# EAGLE schematic Audio Amplifier (EAGLE 7.5.0)
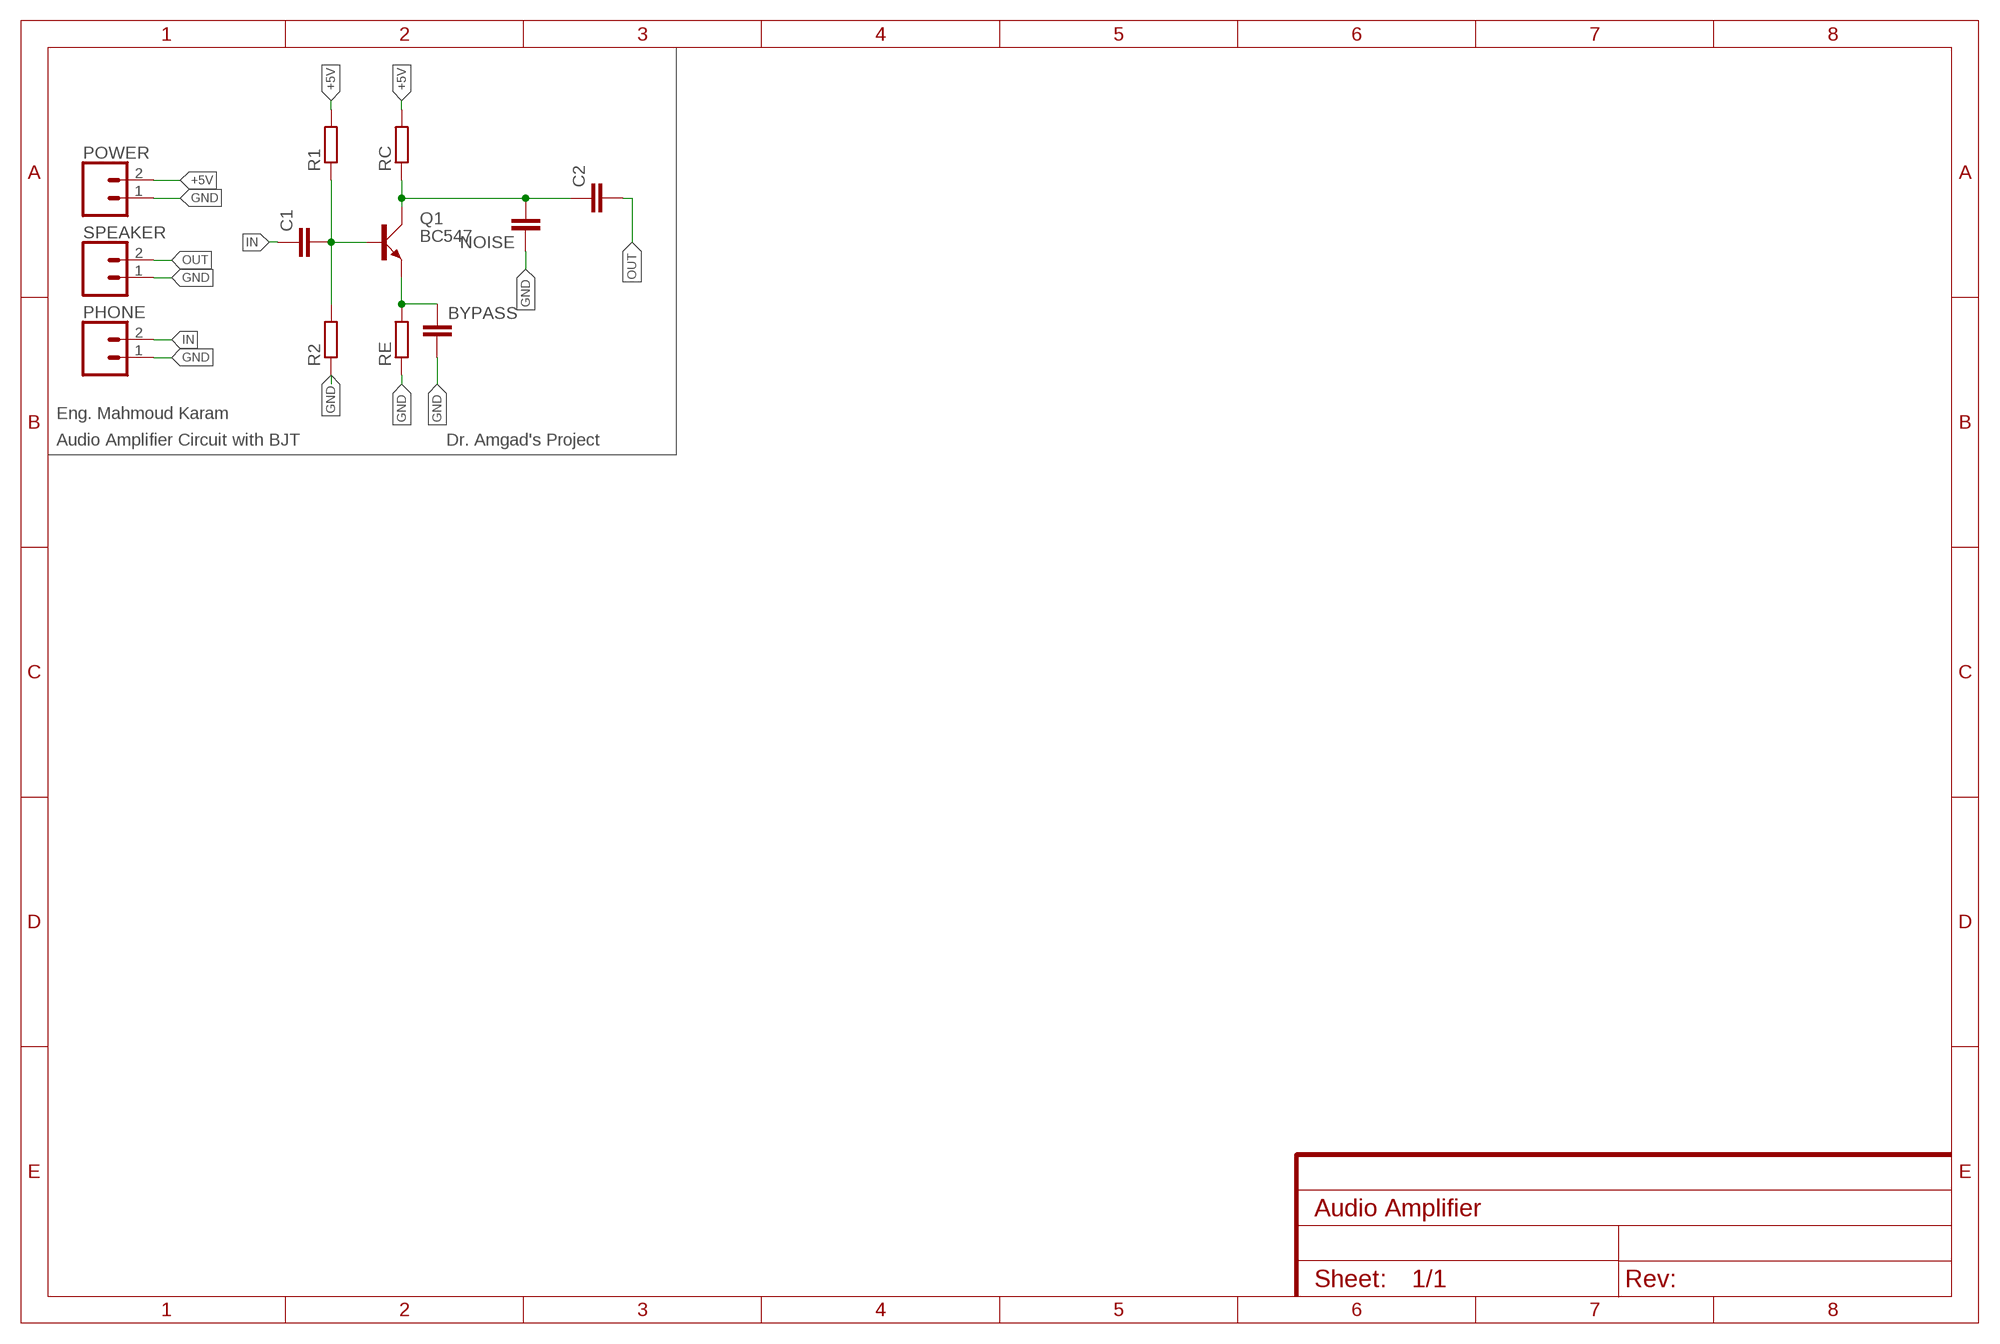
[diagram p0: schematic, sheet 1]

## Parts
BYPASS  C10/4  [C10B4]
C1  C2.5/5  [C2.5-5]
C2  C2.5/5  [C2.5-5]
NOISE  C2.5/5  [C2.5-5]
PHONE  CONN_02JST-PTH-2  [JST-2-PTH]
POWER  CONN_02JST-PTH-2  [JST-2-PTH]
Q1  BC547  [SOT54A]
R1  R-EU_0204/7  [0204/7]
R2  R-EU_0204/7  [0204/7]
RC  R-EU_0204/7  [0204/7]
RE  R-EU_0204/7  [0204/7]
SPEAKER  CONN_02JST-PTH-2  [JST-2-PTH]

## Nets
+5V: POWER.2 R1.2 RC.2
GND: BYPASS.2 NOISE.1 PHONE.1 POWER.1 R2.1 RE.1 SPEAKER.1
IN: C1.1 PHONE.2
N$1: C2.1 NOISE.2 Q1.C RC.1
N$2: BYPASS.1 Q1.E RE.2
N$3: C1.2 Q1.B R1.1 R2.2
OUT: C2.2 SPEAKER.2

## Notes on the sheet
- Eng. Mahmoud Karam
- Audio Amplifier Circuit with BJT | Dr. Amgad's Project

## Library data of the parts
BYPASS C1 C2 NOISE = capacitor-wima:C: CAPACITOR naming: grid - package width
PHONE POWER SPEAKER = SparkFun-Connectors:CONN_02: Multi connection point. Often used as Generic Header-pin footprint for 0.1 inch spaced/style header connections On any of the 0.1 inch spaced packages, you can populate with these: Break Away Headers - Straight <https://www.sparkfun.com/products/116> (PRT-00116) Break Away Male Headers - Right Angle <https://www.sparkfun.com/products/553> (PRT-00553) Female Headers <https://www.sparkfun.com/products/115> (PRT-00115) Break Away Headers - Machine Pin <https://www.sparkfun.com/products/117> (PRT-00117) Break Away Female Headers - Swiss Machine Pin <https://www.sparkfun.com/products/743> (PRT-00743) For SCREWTERMINALS and SPRING TERMINALS visit here: Screw Terimnals on SparkFun.com <https://www.sparkfun.com/search/results?term=Screw+Terminals> (5mm/3.5mm/2.54mm spacing) This device is also useful as a general connection point to wire up your design to another part of your project. Our various solder wires solder well into these plated through hole pads. Hook-Up Wire - Assortment (Stranded, 22 AWG) <https://www.sparkfun.com/products/11375> (PRT-11375) Hook-Up Wire - Assortment (Solid Core, 22 AWG) <https://www.sparkfun.com/products/11367> (PRT-11367) View the entire wire category on our website here <https://www.sparkfun.com/categories/141> Special notes: Molex polarized connector foot print use with: PRT-08233 with associated crimp pins and housings. 2.54_SCREWTERM for use with PRT-10571. 3.5mm Screw Terminal footprints for PRT-08084 5mm Screw Terminal footprints for use with PRT-08432; PROD_ID: CONN-09863; SKU: PRT-09914
Q1 = transistor-small-signal:BC547: NPN TRANSISTOR
R1 R2 RC RE = resistor:R-EU_: RESISTOR, European symbol